# EAGLE design nChannel (EAGLE 9.3.0)
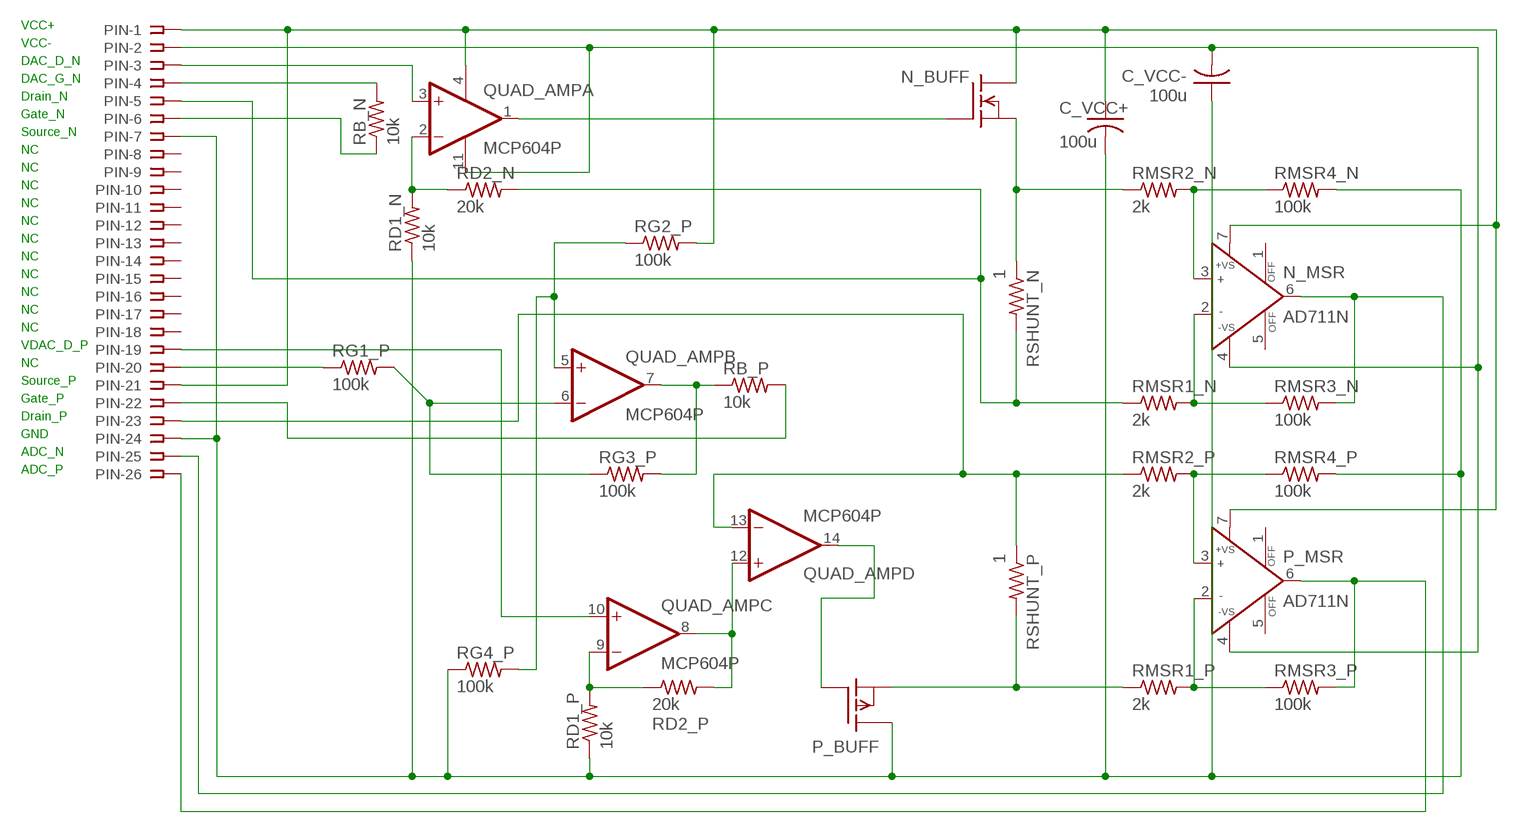
[diagram p0: schematic, sheet 1]

## Parts
C_VCC+  100u  C-US025-024X044  [C025-024X044]
C_VCC-  100u  C-US025-024X044  [C025-024X044]
N_BUFF  BSS101  [TO92]
N_MSR  AD711N  [DIL08]
P_BUFF  BSS110  [TO92]
P_MSR  AD711N  [DIL08]
PIN  SSW-126-02-G-S  [SSW-126-02-G-S]
QUAD_AMP  MCP604P  [DIL14]
RB_N  10k  R-US_0204/5  [0204/5]
RB_P  10k  R-US_0204/5  [0204/5]
RD1_N  10k  R-US_0204/5  [0204/5]
RD1_P  10k  R-US_0204/5  [0204/5]
RD2_N  20k  R-US_0204/5  [0204/5]
RD2_P  20k  R-US_0204/5  [0204/5]
RG1_P  100k  R-US_0204/5  [0204/5]
RG2_P  100k  R-US_0204/5  [0204/5]
RG3_P  100k  R-US_0204/5  [0204/5]
RG4_P  100k  R-US_0204/5  [0204/5]
RMSR1_N  2k  R-US_0204/5  [0204/5]
RMSR1_P  2k  R-US_0204/5  [0204/5]
RMSR2_N  2k  R-US_0204/5  [0204/5]
RMSR2_P  2k  R-US_0204/5  [0204/5]
RMSR3_N  100k  R-US_0204/5  [0204/5]
RMSR3_P  100k  R-US_0204/5  [0204/5]
RMSR4_N  100k  R-US_0204/5  [0204/5]
RMSR4_P  100k  R-US_0204/5  [0204/5]
RSHUNT_N  1  R-US_0204/5  [0204/5]
RSHUNT_P  1  R-US_0204/5  [0204/5]

## Nets
N$1: C_VCC+.2 C_VCC-.1 P_BUFF.3(D) PIN.7 PIN.24 RD1_N.1 RD1_P.1 RG4_P.1 RMSR4_N.2 RMSR4_P.2
N$2: PIN.22 RB_P.2
N$3: PIN.20 RG1_P.1
N$5: PIN.3 QUAD_AMP.3(A:+IN)
N$6: N_MSR.3(IN+) RMSR2_N.2 RMSR4_N.1
N$7: N_MSR.2(IN-) RMSR1_N.2 RMSR3_N.1
N$8: N_MSR.6(OUT) PIN.25 RMSR3_N.2
N$13: QUAD_AMP.7(B:OUT) RB_P.1 RG3_P.2
N$15: QUAD_AMP.9(C:-IN) RD1_P.2 RD2_P.1
N$17: PIN.6 RB_N.1
N$18: P_MSR.3(IN+) RMSR2_P.2 RMSR4_P.1
N$19: P_MSR.2(IN-) RMSR1_P.2 RMSR3_P.1
N$20: P_MSR.6(OUT) PIN.26 RMSR3_P.2
N$21: P_BUFF.2(G) QUAD_AMP.14(D:OUT)
N$22: C_VCC-.2 N_MSR.4(-VS) P_MSR.4(-VS) PIN.2 QUAD_AMP.11(P:V-)
N$23: N_BUFF.2(G) QUAD_AMP.1(A:OUT)
N$24: QUAD_AMP.2(A:-IN) RD1_N.2 RD2_N.1
N$25: N_BUFF.1(S) RMSR2_N.1 RSHUNT_N.1
N$26: PIN.5 RD2_N.2 RMSR1_N.1 RSHUNT_N.2
N$27: PIN.4 RB_N.2
N$28: QUAD_AMP.8(C:OUT) QUAD_AMP.12(D:+IN) RD2_P.2
N$29: P_BUFF.1(S) RMSR1_P.1 RSHUNT_P.2
N$31: PIN.23 QUAD_AMP.13(D:-IN) RMSR2_P.1 RSHUNT_P.1
N$32: C_VCC+.1 N_BUFF.3(D) N_MSR.7(+VS) P_MSR.7(+VS) PIN.1 PIN.21 QUAD_AMP.4(P:V+) RG2_P.2
N$33: QUAD_AMP.6(B:-IN) RG1_P.2 RG3_P.1
N$54: QUAD_AMP.5(B:+IN) RG2_P.1 RG4_P.2
RVG_P: PIN.19 QUAD_AMP.10(C:+IN)
Unconnected: N_MSR.1(OFF) N_MSR.5(OFF) P_MSR.1(OFF) P_MSR.5(OFF) PIN.8 PIN.9 PIN.10 PIN.11 PIN.12 PIN.13 PIN.14 PIN.15 PIN.16 PIN.17 PIN.18

## Notes on the sheet
- VCC+
- VCC-
- DAC_D_N
- DAC_G_N
- Drain_N
- Gate_N
- Source_N
- NC
- NC
- NC
- NC
- NC
- NC
- NC
- NC
- NC
- NC
- NC
- VDAC_D_P
- NC
- Source_P
- Gate_P
- Drain_P
- GND
- ADC_N
- ADC_P

## Library data of the parts
C_VCC+ C_VCC- = rcl:C-US: CAPACITOR, American symbol; SPICEPREFIX: C
N_BUFF = transistor-fet:BSS101: N-Channel Enhancement MOSFET 200V; 0,16A; 11Ohm
N_MSR P_MSR = analog-devices:AD711: Precision, Low Cost, High Speed, BiFET Op Amp Source: http://www.analog.com/static/imported-files/data_sheets/AD711.pdf; MPN: AD711BQ; OC_FARNELL: 9604839; OC_NEWARK: 66F5826
P_BUFF = transistor-fet:BSS110: P-Channel Enhancement MOSFET -50V; -0,17A; 6Ohm
PIN = con-samtec:SSW-126-02-G-S: THROUGH-HOLE .025" SQ POST SOCKET Source: Samtec SSW.pdf; MF: Samtec Inc.; MPN: SSW-126-02-G-S; OC_FARNELL: unknown; OC_NEWARK: 11P9742
QUAD_AMP = linear:MCP604: Quad Op Amp 2.7V to 6.0V Single Supply CMOS Source: http://ww1.microchip.com/downloads/en/DeviceDoc/21314g.pdf
RB_N RB_P RD1_N RD1_P RD2_N RD2_P RG1_P RG2_P RG3_P RG4_P RMSR1_N RMSR1_P RMSR2_N RMSR2_P RMSR3_N RMSR3_P RMSR4_N RMSR4_P = rcl:R-US_: RESISTOR, American symbol; SPICEPREFIX: R
RSHUNT_N RSHUNT_P = rcl:R-US_: RESISTOR, American symbol; SPICEPREFIX: 52

## Board
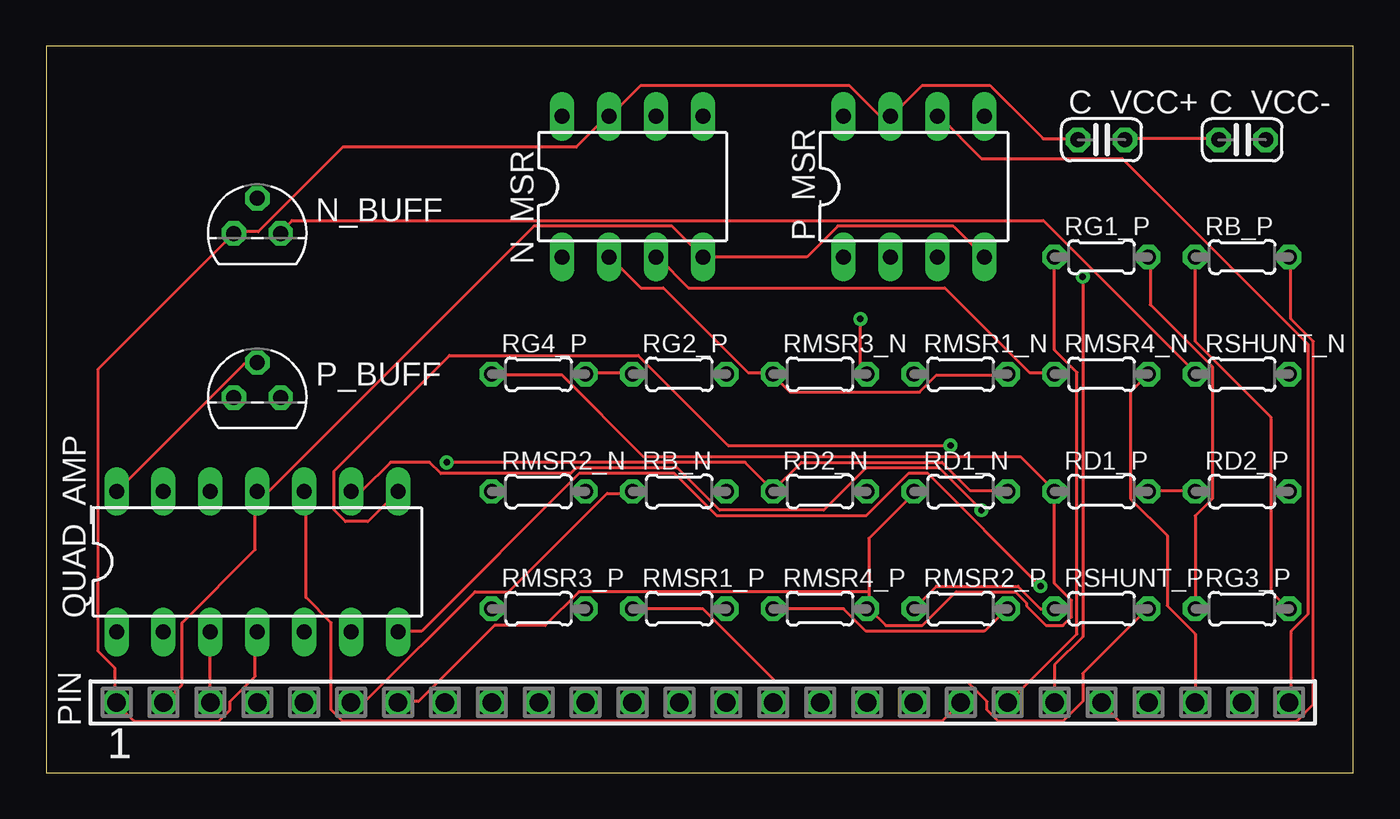
[diagram p1: board, top side]
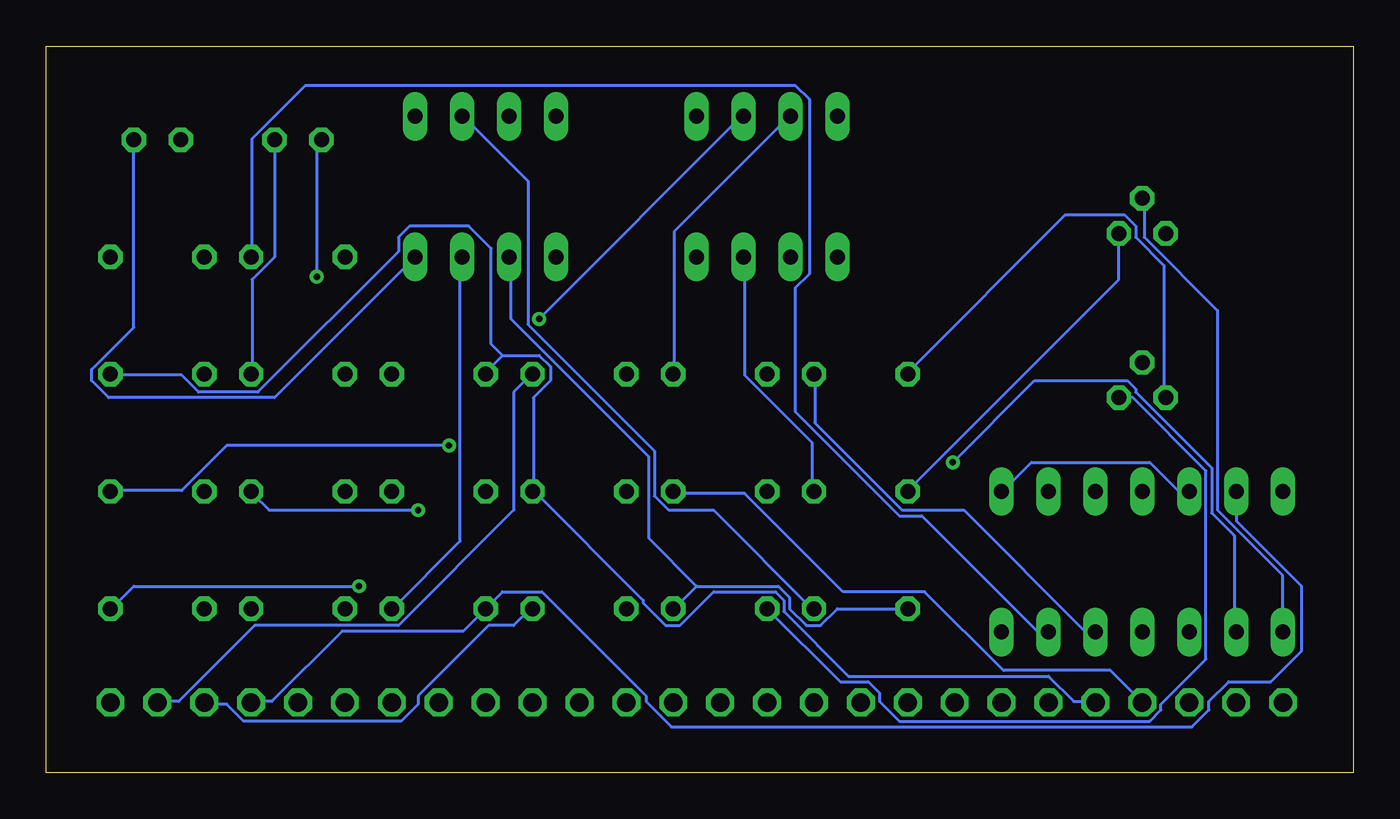
[diagram p2: board, bottom side, seen from below]

Size 70.79 x 39.36 mm. Coordinates in mm from the lower left corner, seen from the top.
Outline: 0,0 70.79,0 70.79,39.36 0,39.36 0,0
Copper layers (1*16): Top 0.035mm / dielectric 1.5mm / Bottom 0.035mm
Design rules "default": minimum track width 6mil, minimum drill 0.35mm, track to track 6mil, track to pad 6mil, pad to pad 6mil, via to via 6mil, smd to smd 6mil, copper to edge 40mil, drill to drill 6mil, minimum pad ring 10mil, minimum via ring 8mil, stop-mask expansion 4mil, vias tented up to drill 0mil, thermal gap 10mil

### Footprints (pad centres in the part's own frame; a part is rotated, then mirrored left to right if it is on the bottom)
C025-024X044 = drill 0.813 octagon: 1 -1.27,0; 2 1.27,0
TO92 = drill 0.813 octagon: 1 1.27,0; 2 0,1.905; 3 -1.27,0
DIL08 = drill 0.813 long: 1 -3.81,-3.81; 2 -1.27,-3.81; 3 1.27,-3.81; 4 3.81,-3.81; 5 3.81,3.81; 6 1.27,3.81; 7 -1.27,3.81; 8 -3.81,3.81
SSW-126-02-G-S = drill 1 pad 1.5 octagon: 1 -31.75,0; 2 -29.21,0; 3 -26.67,0; 4 -24.13,0; 5 -21.59,0; 6 -19.05,0; 7 -16.51,0; 8 -13.97,0; 9 -11.43,0; 10 -8.89,0; 11 -6.35,0; 12 -3.81,0; 13 -1.27,0; 14 1.27,0; 15 3.81,0; 16 6.35,0; 17 8.89,0; 18 11.43,0; 19 13.97,0; 20 16.51,0; 21 19.05,0; 22 21.59,0; 23 24.13,0; 24 26.67,0; 25 29.21,0; 26 31.75,0
DIL14 = drill 0.813 long: 1 -7.62,-3.81; 2 -5.08,-3.81; 3 -2.54,-3.81; 4 0,-3.81; 5 2.54,-3.81; 6 5.08,-3.81; 7 7.62,-3.81; 8 7.62,3.81; 9 5.08,3.81; 10 2.54,3.81; 11 0,3.81; 12 -2.54,3.81; 13 -5.08,3.81; 14 -7.62,3.81
0204/5 = drill 0.813 octagon: 1 -2.54,0; 2 2.54,0

### Placement (x,y rotation side)
C_VCC+  57.15,34.29 0 top
C_VCC-  64.77,34.29 0 top
N_BUFF  11.43,29.21 0 top
N_MSR  31.75,31.75 0 top
P_BUFF  11.43,20.32 0 top
P_MSR  46.99,31.75 0 top
PIN  35.56,3.81 0 top
QUAD_AMP  11.43,11.43 0 top
RB_N  34.29,15.24 0 top
RB_P  64.77,27.94 0 top
RD1_N  49.53,15.24 0 top
RD1_P  57.15,15.24 0 top
RD2_N  41.91,15.24 0 top
RD2_P  64.77,15.24 0 top
RG1_P  57.15,27.94 0 top
RG2_P  34.29,21.59 0 top
RG3_P  64.77,8.89 0 top
RG4_P  26.67,21.59 0 top
RMSR1_N  49.53,21.59 0 top
RMSR1_P  34.29,8.89 0 top
RMSR2_N  26.67,15.24 0 top
RMSR2_P  49.53,8.89 0 top
RMSR3_N  41.91,21.59 0 top
RMSR3_P  26.67,8.89 0 top
RMSR4_N  57.15,21.59 0 top
RMSR4_P  41.91,8.89 0 top
RSHUNT_N  64.77,21.59 0 top
RSHUNT_P  57.15,8.89 0 top

### Tracks (layer width: path | path; a pad name or v marks a point on that pad's centre or on a via)
N$1
  Top 0.152: C_VCC+.2 58.42,34.34 63.45,34.34 C_VCC-.1 | PIN.24 62.23,7.52 60.71,9.04 60.71,12.85 58.73,14.83 58.73,20.62 RMSR4_N.2 | 44.55,9.8 44.55,12.7 46.99,15.14 RD1_N.1 | 44.55,9.8 44.55,8.89 | 44.55,8.89 45.47,7.98 47.45,7.98 49.28,9.8 52.48,9.8 53.09,9.2 53.09,9.04 54.15,7.98 55.07,7.98 55.52,8.43 55.52,9.35 54.61,10.26 RD1_P.1 54.61,15.29 52.78,17.12 32.36,17.12 27.94,21.54 24.13,21.54 RG4_P.1 | 44.55,8.89 RMSR4_P.2 | 44.55,9.8 28.85,9.8 27.03,7.98 24.28,7.98 20.17,3.86 19.1,3.86 PIN.7
  Bottom 0.152: C_VCC+.2 58.42,27.94 59.64,26.72 59.64,21.69 RMSR4_N.2 | P_BUFF.3 10.26,20.32 10.26,27.48 11.79,29.01 11.79,29.62 12.39,30.23 15.6,30.23 24.13,21.69 RG4_P.1 | PIN.24 62.23,3.71 61.01,3.71 60.1,2.79 51.56,2.79 50.65,3.71 50.65,4.17 46.84,7.98 45.47,7.98 44.55,8.89 RMSR4_P.2
N$2
  Top 0.152: RB_P.2 67.41,27.94 67.41,24.59 68.63,23.37 68.63,3.71 67.72,2.79 58.12,2.79 57.2,3.71 PIN.22
N$3
  Top 0.152: RG1_P.1 54.61,22.91 55.83,21.69 55.83,7.52 52.17,3.86 PIN.20
N$5
  Top 0.152: PIN.3 QUAD_AMP.3
N$6
  Top 0.152: RMSR4_N.1 54.61,21.69 53.24,21.69 48.67,26.26 34.8,26.26 33.12,27.94 N_MSR.3
  Bottom 0.152: RMSR2_N.2 29.31,15.29 29.31,17.88 32.97,21.54 32.97,27.94 N_MSR.3
N$7
  Top 0.152: N_MSR.2 30.53,27.94 32.21,26.26 33.43,26.26 38,21.69 39.37,21.69 RMSR3_N.1 39.37,21.54 40.28,20.62 47.29,20.62 48.21,21.54 52.02,21.54 RMSR1_N.2
N$8  (via drill 0.35)
  Top 0.152: v44.09,24.59 44.09,22 44.4,21.69 RMSR3_N.2
  Bottom 0.152: v44.09,24.59 33.12,35.56 N_MSR.6 | PIN.25 64.67,3.86 63.6,3.86 59.49,7.98 51.71,7.98 45.47,14.22 45.47,20.62 44.55,21.54 RMSR3_N.2
N$13  (via drill 0.35)
  Top 0.152: v53.85,10.11 47.75,16.2 46.68,16.2 44.4,13.92 36.32,13.92 34.04,16.2 28.85,16.2 20.32,7.67 19.1,7.67 QUAD_AMP.7 | RB_P.1 62.23,23.37 66.34,19.25 66.34,9.8 67.26,8.89 RG3_P.2
  Bottom 0.152: v53.85,10.11 66.04,10.11 67.26,8.89 RG3_P.2
N$15  (via drill 0.35)
  Top 0.152: v50.65,14.22 48.36,16.51 44.4,16.51 42.11,14.22 36.47,14.22 34.19,16.51 28.7,16.51 28.4,16.2 21.39,16.2 20.78,16.82 18.64,16.82 17.12,15.29 16.51,15.29 QUAD_AMP.9 | RD2_P.1 62.23,15.29 59.79,15.29 RD1_P.2
  Bottom 0.152: v50.65,14.22 58.73,14.22 59.64,15.14 RD1_P.2
N$17
  Top 0.152: RB_N.1 31.75,15.14 30.38,15.14 25.04,9.8 23.22,9.8 17.27,3.86 16.51,3.86 PIN.6
N$18
  Top 0.152: RMSR4_P.1 43.18,8.89 44.4,7.67 50.8,7.67 52.02,8.89 RMSR2_P.2
  Bottom 0.152: P_MSR.3 48.36,27.94 48.36,12.55 52.02,8.89 RMSR2_P.2
N$19
  Bottom 0.152: RMSR3_P.1 27.94,8.89 28.85,7.98 29.62,7.98 30.53,8.89 30.53,9.5 31.14,10.11 35.56,10.11 | 35.56,10.11 36.78,8.89 RMSR1_P.2 | 35.56,10.11 38.15,12.7 38.15,17.12 45.62,24.59 45.62,27.94 P_MSR.2
N$20
  Top 0.152: PIN.26 67.41,3.86 67.41,7.67 68.33,8.59 68.33,23.22 58.27,33.27 50.65,33.27 48.36,35.56 P_MSR.6
  Bottom 0.152: RMSR3_P.2 29.31,8.89 34.65,14.22 37.08,14.22 37.85,14.99 37.85,17.42 44.7,24.28 44.7,32.05 48.21,35.56 P_MSR.6
N$21
  Top 0.152: QUAD_AMP.14 10.72,22.15 11.33,22.15 P_BUFF.2
N$22
  Top 0.152: PIN.2 6.45,3.86 7.37,4.78 7.37,8.13 11.33,12.09 11.33,15.14 QUAD_AMP.11 11.48,15.29 12.09,15.29 26.42,29.62 33.88,29.62 N_MSR.4 41.2,27.94 42.87,29.62 49.12,29.62 P_MSR.4
  Bottom 0.152: C_VCC-.2 66.04,24.13 68.33,21.84 68.33,21.23 67.41,20.32 58.42,20.32 P_MSR.4
N$23
  Bottom 0.152: QUAD_AMP.1 3.86,7.67 3.86,10.72 7.37,14.22 7.37,25.04 11.33,29.01 11.33,30.99 N_BUFF.2
N$24  (via drill 0.35)
  Top 0.152: v21.69,16.82 37.85,16.82 39.37,15.29 | 39.37,15.29 40.89,16.82 48.51,16.82 50.04,15.29 52.02,15.29 RD1_N.2 | 39.37,15.29 RD2_N.1
  Bottom 0.152: v21.69,16.82 17.27,21.23 12.24,21.23 11.79,20.78 11.79,20.62 7.67,16.51 7.67,14.07 6.45,12.85 6.45,7.67 QUAD_AMP.2
N$25
  Top 0.152: RSHUNT_N.1 62.23,21.69 54,29.92 13.31,29.92 12.7,29.31 N_BUFF.1
  Bottom 0.152: N_BUFF.1 12.7,26.72 24.13,15.29 RMSR2_N.1
N$26
  Bottom 0.152: 44.4,15.29 44.4,20.32 43.48,21.23 43.48,22 44.09,22.61 46.08,22.61 | 46.08,22.61 46.99,21.69 RMSR1_N.1 | 46.08,22.61 46.68,23.22 46.68,28.4 47.9,29.62 51.1,29.62 51.71,29.01 51.71,28.25 59.33,20.62 62.54,20.62 63.45,21.54 67.26,21.54 RSHUNT_N.2 | 44.4,15.29 38.46,9.35 38.46,9.2 37.24,7.98 36.47,7.98 34.65,9.8 31.29,9.8 30.84,9.35 30.84,8.74 27.33,5.23 16.51,5.23 15.14,3.86 14.07,3.86 PIN.5 | 44.4,15.29 RD2_N.2
N$27
  Bottom 0.152: PIN.4 13.16,5.54 18.95,5.54 23.22,9.8 27.63,9.8 32.97,15.14 36.78,15.14 RB_N.2
N$28  (via drill 0.35)
  Top 0.152: v48.97,17.73 36.93,17.73 32.05,22.61 21.84,22.61 15.6,16.36 15.6,14.22 16.2,13.61 17.42,13.61 QUAD_AMP.8
  Bottom 0.152: QUAD_AMP.12 8.89,15.29 9.5,15.29 11.02,16.82 17.42,16.82 18.95,15.29 QUAD_AMP.8 | v48.97,17.73 61.01,17.73 63.45,15.29 67.26,15.29 RD2_P.2
N$29
  Top 0.152: RMSR1_P.1 35.56,8.89 39.52,4.93 49.89,4.93 50.95,3.86 50.95,3.4 51.56,2.79 55.07,2.79 56.13,3.86 56.13,5.38 59.64,8.89 RSHUNT_P.2
  Bottom 0.152: P_BUFF.1 11.94,20.32 7.98,16.36 7.98,6.15 10.41,3.71 10.41,3.4 11.02,2.79 24.59,2.79 25.65,3.86 25.65,4.32 26.26,4.93 27.79,4.93 RMSR1_P.1
N$31
  Top 0.152: RSHUNT_P.1 53.85,8.89 52.63,10.11 48.21,10.11 RMSR2_P.1
  Bottom 0.152: QUAD_AMP.13 6.3,15.14 6.3,13.61 2.79,10.11 2.79,6.6 4.47,4.93 6.76,4.93 7.82,3.86 7.82,3.4 8.74,2.49 36.93,2.49 38.3,3.86 38.3,4.17 43.94,9.8 46.08,9.8 RMSR2_P.1 48.21,7.67 54.76,7.67 58.57,3.86 59.64,3.86 PIN.23
N$32  (via drill 0.35)
  Top 0.152: C_VCC+.1 55.83,34.34 54,34.34 51.1,37.24 47.45,37.24 45.77,35.56 P_MSR.7 45.16,35.56 43.48,37.24 32.21,37.24 30.53,35.56 N_MSR.7 30.38,35.56 28.7,33.88 16.05,33.88 11.48,29.31 10.26,29.31 N_BUFF.3 2.79,21.84 2.79,6.6 3.71,5.69 3.71,3.86 PIN.1 3.86,3.71 4.77,2.79 9.35,2.79 9.96,3.4 9.96,3.86 11.33,5.23 11.33,7.52 QUAD_AMP.4 | PIN.21 54.61,5.84 56.13,7.37 v56.13,26.87
  Bottom 0.152: v56.13,26.87 56.13,34.04 C_VCC+.1 | RG2_P.2 36.78,21.69 36.78,29.31 30.53,35.56 N_MSR.7
N$33
  Top 0.152: RG3_P.1 62.23,13.92 63.14,14.83 63.14,22 59.79,25.35 59.79,27.94 RG1_P.2
  Bottom 0.152: QUAD_AMP.6 16.51,7.67 17.12,7.67 23.37,13.92 24.59,13.92 30.23,19.56 30.23,26.26 29.46,27.03 29.46,36.47 30.23,37.24 56.74,37.24 59.64,34.34 59.64,27.94 RG1_P.2
N$54
  Top 0.152: RG2_P.1 31.75,21.69 29.31,21.69 RG4_P.2
  Bottom 0.152: QUAD_AMP.5 14.07,7.67 14.53,7.67 21.08,14.22 24.44,14.22 29.16,18.95 29.16,21.54 RG4_P.2
RVG_P
  Top 0.152: PIN.19 48.51,2.79 16.05,2.79 15.44,3.4 15.44,8.13 14.07,9.5 14.07,15.14 QUAD_AMP.10